# Altium schematic sheet MainSch.SchDoc
size A3; SheetNumber: 1; SheetTotal: 1
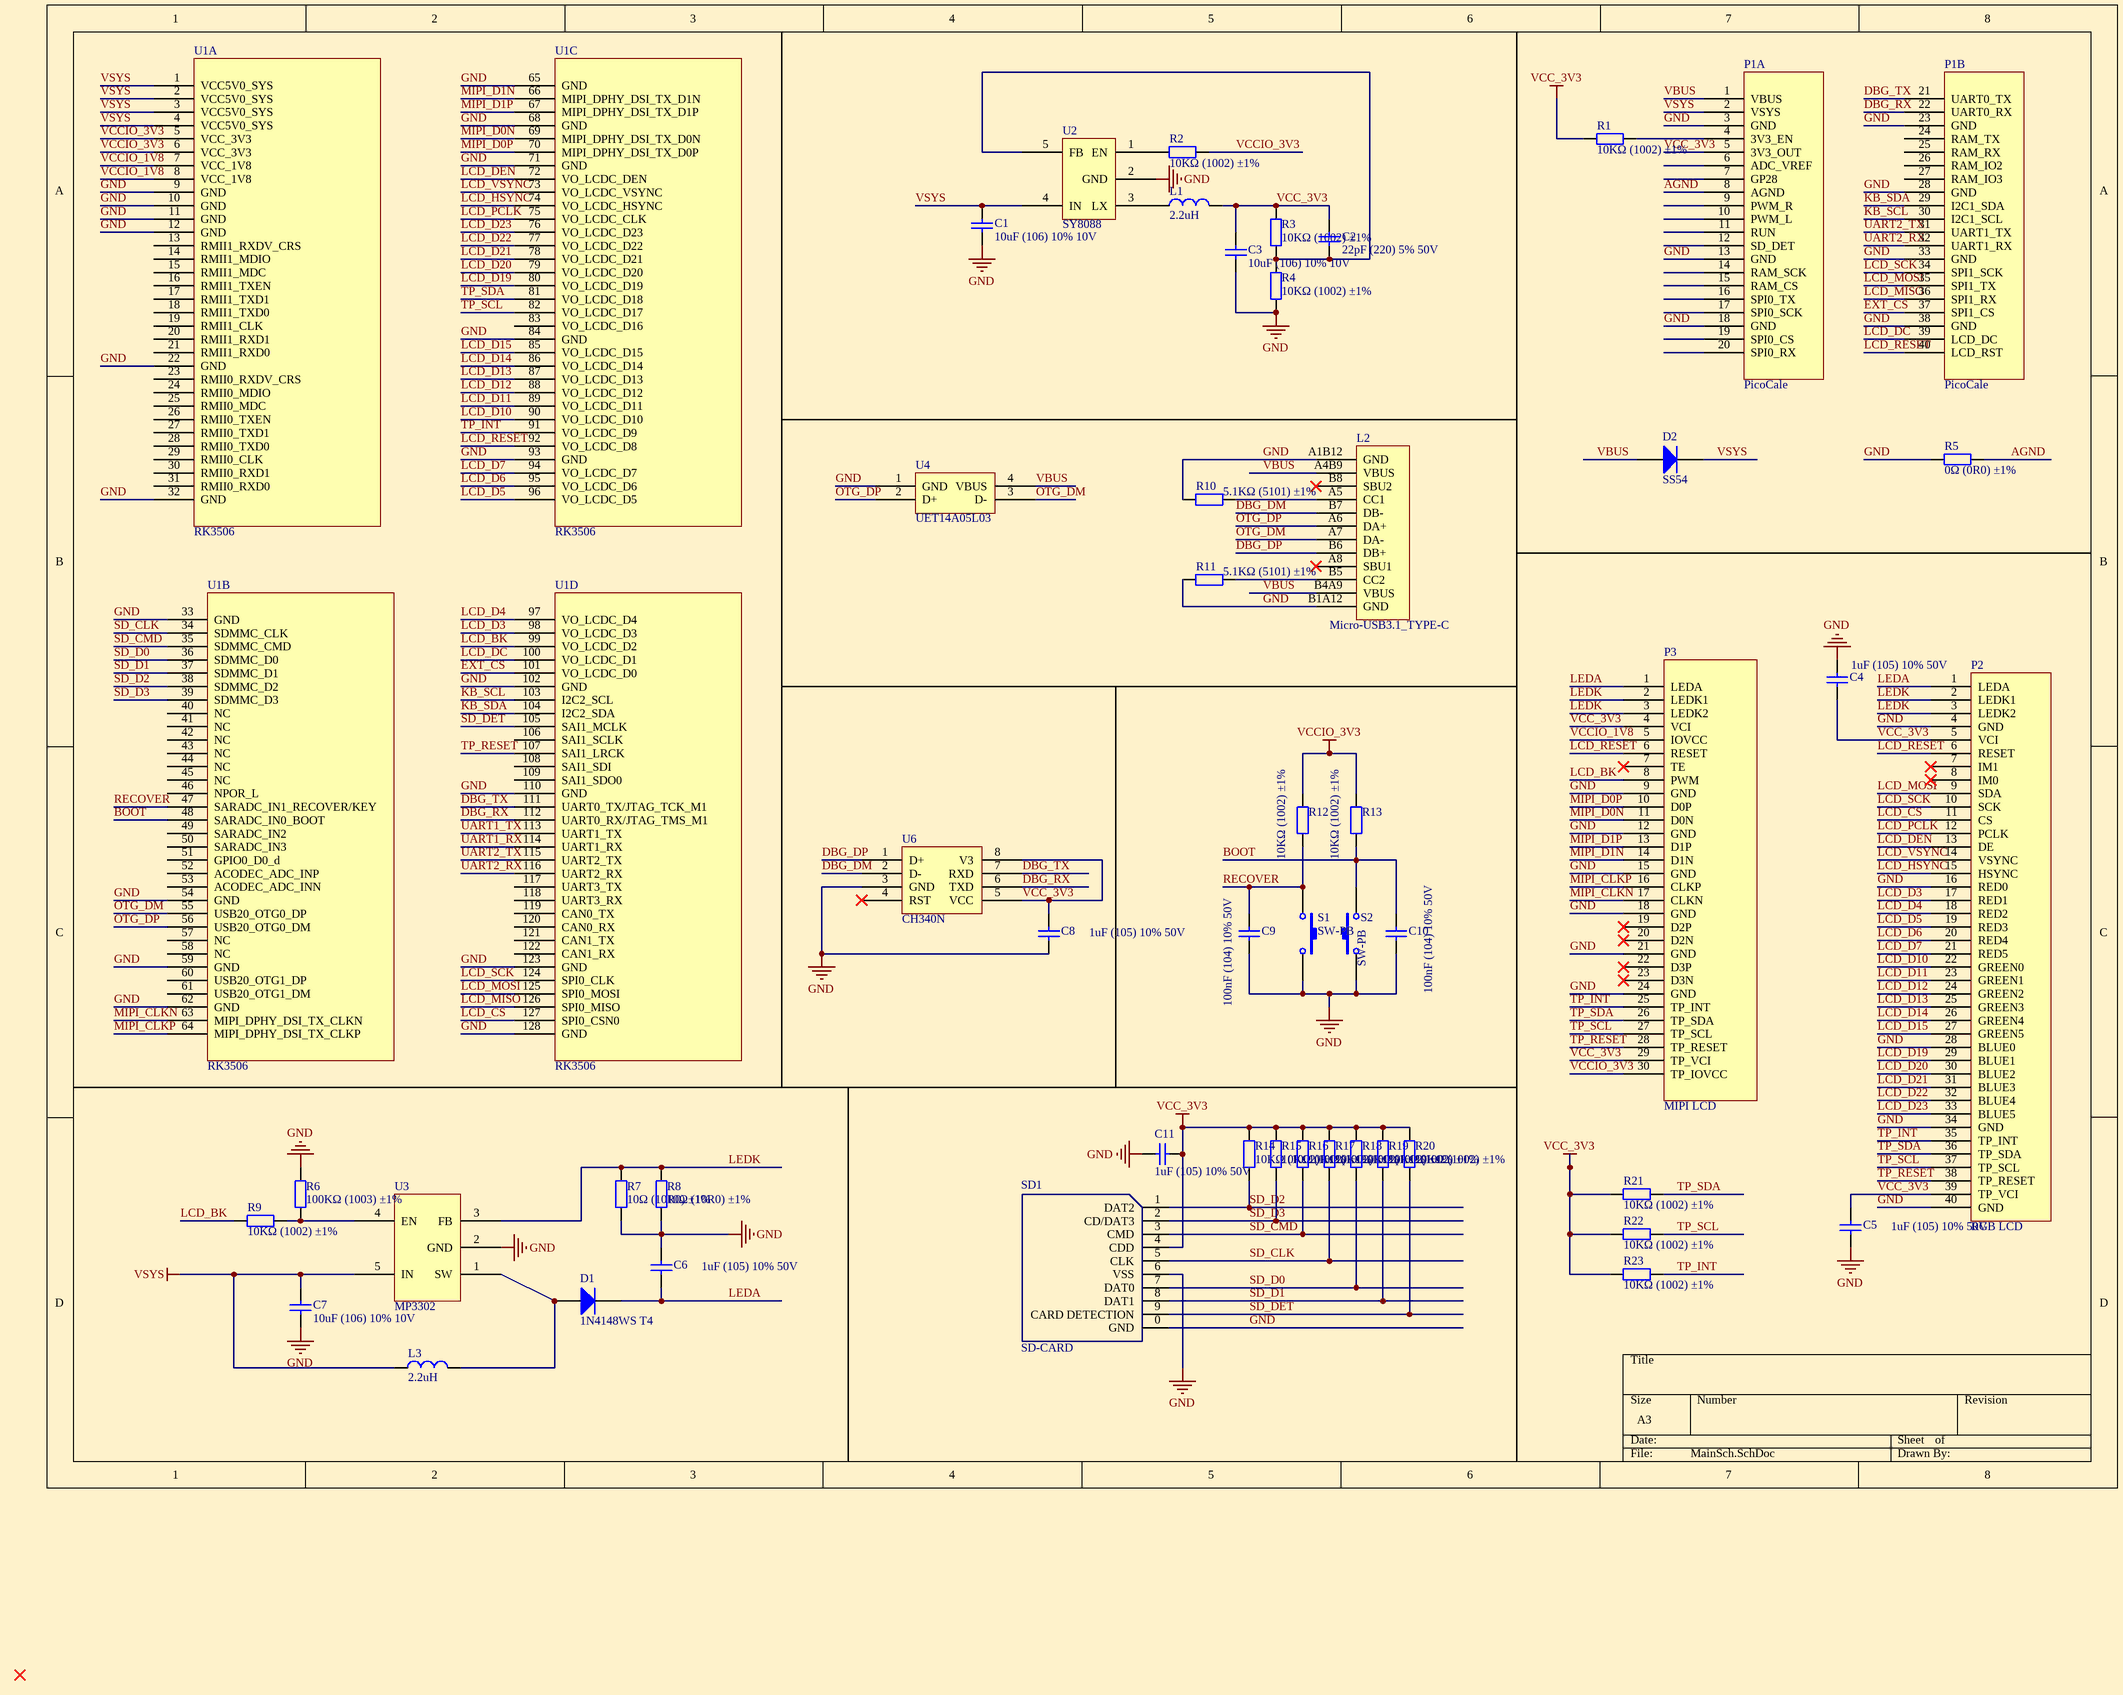
[diagram p0: MainSch.SchDoc]

## Parts
C1  10uF (106) 10% 10V  [LC-0603_C]
C2  22pF (220) 5% 50V  [LC-0603_C]
C3  10uF (106) 10% 10V  [LC-0603_C]
C4  1uF (105) 10% 50V  [LC-0603_C]
C5  1uF (105) 10% 50V  [LC-0603_C]
C6  1uF (105) 10% 50V  [LC-0603_C]
C7  10uF (106) 10% 10V  [LC-0603_C]
C8  1uF (105) 10% 50V  [LC-0603_C]
C9  100nF (104) 10% 50V  [LC-0603_C]
C10  100nF (104) 10% 50V  [LC-0603_C]
C11  1uF (105) 10% 50V  [LC-0603_C]
D1  1N4148WS T4  [LC-SOD-323]
D2  SS54  [LC-SMA(DO-214AC)_S1]
L1  2.2uH  [L-CD52]
L2  Micro-USB3.1_TYPE-C  [USB_TypeC_SMD_16P]
L3  2.2uH  [L-CD52]
P1  PicoCale  [Pico]  (parts A,B of 2)
P2  RGB LCD  [FPC0.5-40]
P3  MIPI LCD  [FPC0.5-30]
R1  10KΩ (1002) ±1%  [LC-0603_R]
R2  10KΩ (1002) ±1%  [LC-0603_R]
R3  10KΩ (1002) ±1%  [LC-0603_R]
R4  10KΩ (1002) ±1%  [LC-0603_R]
R5  0Ω (0R0) ±1%  [LC-0603_R]
R6  100KΩ (1003) ±1%  [LC-0603_R]
R7  10Ω (10R0) ±1%  [LC-0603_R]
R8  10Ω (10R0) ±1%  [LC-0603_R]
R9  10KΩ (1002) ±1%  [LC-0603_R]
R10  5.1KΩ (5101) ±1%  [LC-0603_R]
R11  5.1KΩ (5101) ±1%  [LC-0603_R]
R12  10KΩ (1002) ±1%  [LC-0603_R]
R13  10KΩ (1002) ±1%  [LC-0603_R]
R14  10KΩ (1002) ±1%  [LC-0603_R]
R15  10KΩ (1002) ±1%  [LC-0603_R]
R16  10KΩ (1002) ±1%  [LC-0603_R]
R17  10KΩ (1002) ±1%  [LC-0603_R]
R18  10KΩ (1002) ±1%  [LC-0603_R]
R19  10KΩ (1002) ±1%  [LC-0603_R]
R20  10KΩ (1002) ±1%  [LC-0603_R]
R21  10KΩ (1002) ±1%  [LC-0603_R]
R22  10KΩ (1002) ±1%  [LC-0603_R]
R23  10KΩ (1002) ±1%  [LC-0603_R]
S1  SW-PB  [TS-1030]
S2  SW-PB  [TS-1030]
SD1  SD-CARD  [SD-CARD-Micro]
U1  RK3506  [RK3506]  (parts A,B,C,D of 4)
U2  SY8088  [SOT23-5]
U3  MP3302  [SOT23-5]
U4  UET14A05L03  [SOT-143]
U6  CH340N  [SOP8]

## Nets
GND: C1.1 C3.1 C4.1 C5.1 C6.2 C7.1 C8.1 C9.1 C10.1 C11.2 L2.A1B12(GND) L2.B1A12(GND) P1.3(GND) P1.13(GND) P1.18(GND) P1.23(GND) P1.28(GND) P1.33(GND) P1.38(GND) P2.4(GND) P2.16(RED0) P2.28(BLUE0) P2.34(GND) P2.40(GND) P3.9(GND) P3.12(GND) P3.15(GND) P3.18(GND) P3.21(GND) P3.24(GND) R4.1 R5.1 R6.2 R7.1 R8.1 R10.1 R11.1 S1.2 S2.1 SD1.0(GND) SD1.6(VSS) U1.9(GND) U1.10(GND) U1.11(GND) U1.12(GND) U1.22(GND) U1.32(GND) U1.33(GND) U1.54(GND) U1.59(GND) U1.62(GND) U1.65(GND) U1.68(GND) U1.71(GND) U1.84(GND) U1.93(GND) U1.102(GND) U1.110(GND) U1.123(GND) U1.128(GND) U2.2(GND) U3.2(GND) U4.1(GND) U6.3(GND)
VCC_3V3: C2.2 C3.2 C4.2 C5.2 C8.2 C11.1 L1.1 P1.5(3V3_OUT) P2.5(VCI) P2.39(TP_VCI) P3.4(VCI) P3.29(TP_VCI) R1.1 R3.2 R14.2 R15.2 R16.2 R17.2 R18.2 R19.2 R20.2 R21.2 R22.2 R23.2 SD1.4(CDD) U6.5(VCC) U6.8(V3)
VCCIO_3V3: P3.30(TP_IOVCC) R2.2 R12.2 R13.2 U1.5(VCC_3V3) U1.6(VCC_3V3)
VSYS: C1.2 C7.2 D2.2(K) L3.2 P1.2(VSYS) U1.1(VCC5V0_SYS) U1.2(VCC5V0_SYS) U1.3(VCC5V0_SYS) U1.4(VCC5V0_SYS) U2.4(IN) U3.5(IN)
AGND: P1.8(AGND) R5.2
BOOT: C10.2 R13.1 S2.2 U1.48(SARADC_IN0_BOOT)
DBG_DM: L2.B7(DB-) U6.2(D-)
DBG_DP: L2.B6(DB+) U6.1(D+)
DBG_RX: P1.22(UART0_RX) U1.112(UART0_RX/JTAG_TMS_M1) U6.6(TXD)
DBG_TX: P1.21(UART0_TX) U1.111(UART0_TX/JTAG_TCK_M1) U6.7(RXD)
EXT_CS: P1.37(SPI1_CS) U1.101(VO_LCDC_D0)
KB_SCL: P1.30(I2C1_SCL) U1.103(I2C2_SCL)
KB_SDA: P1.29(I2C1_SDA) U1.104(I2C2_SDA)
LCD_BK: P3.8(PWM) R9.1 U1.99(VO_LCDC_D2)
LCD_CS: P2.11(CS) U1.127(SPI0_CSN0)
LCD_D3: P2.17(RED1) U1.98(VO_LCDC_D3)
LCD_D4: P2.18(RED2) U1.97(VO_LCDC_D4)
LCD_D5: P2.19(RED3) U1.96(VO_LCDC_D5)
LCD_D6: P2.20(RED4) U1.95(VO_LCDC_D6)
LCD_D7: P2.21(RED5) U1.94(VO_LCDC_D7)
LCD_D10: P2.22(GREEN0) U1.90(VO_LCDC_D10)
LCD_D11: P2.23(GREEN1) U1.89(VO_LCDC_D11)
LCD_D12: P2.24(GREEN2) U1.88(VO_LCDC_D12)
LCD_D13: P2.25(GREEN3) U1.87(VO_LCDC_D13)
LCD_D14: P2.26(GREEN4) U1.86(VO_LCDC_D14)
LCD_D15: P2.27(GREEN5) U1.85(VO_LCDC_D15)
LCD_D19: P2.29(BLUE1) U1.80(VO_LCDC_D19)
LCD_D20: P2.30(BLUE2) U1.79(VO_LCDC_D20)
LCD_D21: P2.31(BLUE3) U1.78(VO_LCDC_D21)
LCD_D22: P2.32(BLUE4) U1.77(VO_LCDC_D22)
LCD_D23: P2.33(BLUE5) U1.76(VO_LCDC_D23)
LCD_DC: P1.39(LCD_DC) U1.100(VO_LCDC_D1)
LCD_DEN: P2.13(DE) U1.72(VO_LCDC_DEN)
LCD_HSYNC: P2.15(HSYNC) U1.74(VO_LCDC_HSYNC)
LCD_MISO: P1.36(SPI1_RX) U1.126(SPI0_MISO)
LCD_MOSI: P1.35(SPI1_TX) P2.9(SDA) U1.125(SPI0_MOSI)
LCD_PCLK: P2.12(PCLK) U1.75(VO_LCDC_CLK)
LCD_RESET: P1.40(LCD_RST) P2.6(RESET) P3.6(RESET) U1.92(VO_LCDC_D8)
LCD_SCK: P1.34(SPI1_SCK) P2.10(SCK) U1.124(SPI0_CLK)
LCD_VSYNC: P2.14(VSYNC) U1.73(VO_LCDC_VSYNC)
LEDA: C6.1 D1.2(K) P2.1(LEDA) P3.1(LEDA)
LEDK: P2.2(LEDK1) P2.3(LEDK2) P3.2(LEDK1) P3.3(LEDK2) R7.2 R8.2 U3.3(FB)
MIPI_CLKN: P3.17(CLKN) U1.63(MIPI_DPHY_DSI_TX_CLKN)
MIPI_CLKP: P3.16(CLKP) U1.64(MIPI_DPHY_DSI_TX_CLKP)
MIPI_D0N: P3.11(D0N) U1.69(MIPI_DPHY_DSI_TX_D0N)
MIPI_D0P: P3.10(D0P) U1.70(MIPI_DPHY_DSI_TX_D0P)
MIPI_D1N: P3.14(D1N) U1.66(MIPI_DPHY_DSI_TX_D1N)
MIPI_D1P: P3.13(D1P) U1.67(MIPI_DPHY_DSI_TX_D1P)
OTG_DM: L2.A7(DA-) U1.55(USB20_OTG0_DP) U4.3(D-)
OTG_DP: L2.A6(DA+) U1.56(USB20_OTG0_DM) U4.2(D+)
RECOVER: C9.2 R12.1 S1.1 U1.47(SARADC_IN1_RECOVER/KEY)
SD_CLK: R17.1 SD1.5(CLK) U1.34(SDMMC_CLK)
SD_CMD: R16.1 SD1.3(CMD) U1.35(SDMMC_CMD)
SD_D0: R18.1 SD1.7(DAT0) U1.36(SDMMC_D0)
SD_D1: R19.1 SD1.8(DAT1) U1.37(SDMMC_D1)
SD_D2: R14.1 SD1.1(DAT2) U1.38(SDMMC_D2)
SD_D3: R15.1 SD1.2(CD/DAT3) U1.39(SDMMC_D3)
SD_DET: R20.1 SD1.9(CARD_DETECTION) U1.105(SAI1_MCLK)
TP_INT: P2.35(TP_INT) P3.25(TP_INT) R23.1 U1.91(VO_LCDC_D9)
TP_RESET: P2.38(TP_RESET) P3.28(TP_RESET) U1.107(SAI1_LRCK)
TP_SCL: P2.37(TP_SCL) P3.27(TP_SCL) R22.1 U1.82(VO_LCDC_D17)
TP_SDA: P2.36(TP_SDA) P3.26(TP_SDA) R21.1 U1.81(VO_LCDC_D18)
UART1_RX: U1.114(UART1_RX)
UART1_TX: U1.113(UART1_TX)
UART2_RX: P1.32(UART1_RX) U1.116(UART2_RX)
UART2_TX: P1.31(UART1_TX) U1.115(UART2_TX)
VBUS: D2.1(A) L2.A4B9(VBUS) L2.B4A9(VBUS) P1.1(VBUS) U4.4(VBUS)
VCCIO_1V8: P3.5(IOVCC) U1.7(VCC_1V8) U1.8(VCC_1V8)
NetC2_1: C2.1 R3.1 R4.2 U2.5(FB)
NetD1_1: D1.1(A) L3.1 U3.1(SW)
NetL1_2: L1.2 U2.3(LX)
NetL2_A5: L2.A5(CC1) R10.2
NetL2_B5: L2.B5(CC2) R11.2
NetP1_4: P1.4(3V3_EN) R1.2
NetR2_1: R2.1 U2.1(EN)
NetR6_1: R6.1 R9.2 U3.4(EN)

Not connected (* = marked no-connect by the designer): L2 A8(SBU1)* B8(SBU2)*; P1 6(ADC_VREF) 7(GP28) 9(PWM_R) 10(PWM_L) 11(RUN) 12(SD_DET) 14(RAM_SCK) 15(RAM_CS) 16(SPI0_TX) 17(SPI0_SCK) 19(SPI0_CS) 20(SPI0_RX) 24(RAM_TX) 25(RAM_RX) 26(RAM_IO2) 27(RAM_IO3); P2 7(IM1)* 8(IM0)*; P3 7(TE)* 19(D2P)* 20(D2N)* 22(D3P)* 23(D3N)*; U1 13(RMII1_RXDV_CRS) 14(RMII1_MDIO) 15(RMII1_MDC) 16(RMII1_TXEN) 17(RMII1_TXD1) 18(RMII1_TXD0) 19(RMII1_CLK) 20(RMII1_RXD1) 21(RMII1_RXD0) 23(RMII0_RXDV_CRS) 24(RMII0_MDIO) 25(RMII0_MDC) 26(RMII0_TXEN) 27(RMII0_TXD1) 28(RMII0_TXD0) 29(RMII0_CLK) 30(RMII0_RXD1) 31(RMII0_RXD0) 40(NC) 41(NC) 42(NC) 43(NC) 44(NC) 45(NC) 46(NPOR_L) 49(SARADC_IN2) 50(SARADC_IN3) 51(GPIO0_D0_d) 52(ACODEC_ADC_INP) 53(ACODEC_ADC_INN) 57(NC) 58(NC) 60(USB20_OTG1_DP) 61(USB20_OTG1_DM) 83(VO_LCDC_D16) 106(SAI1_SCLK) 108(SAI1_SDI) 109(SAI1_SDO0) 117(UART3_TX) 118(UART3_RX) 119(CAN0_TX) 120(CAN0_RX) 121(CAN1_TX) 122(CAN1_RX); U6 4(RST)*

## Library data of the parts
C1 C3 C7 = 0603 10uF (106) 10% 10V: 贴片电容; ComponentLink1Description: 供应商链接; ComponentLink1URL: http://www.szlcsc.com/product/details_20411.html; Package: 0603; Supplier: LC; SuppliersPartNumber: C19702
C2 = 0603 22pF (220) 5% 50V: 贴片电容; ComponentLink1Description: 供应商链接; ComponentLink1URL: http://www.szlcsc.com/product/details_2005.html; Package: 0603; Supplier: LC; SuppliersPartNumber: C1653
C4-C6 C8 C11 = 0603 1uF (105) 10% 50V: 贴片电容; ComponentLink1Description: 供应商链接; ComponentLink1URL: http://www.szlcsc.com/product/details_16531.html; Package: 0603; Supplier: LC; SuppliersPartNumber: C15849
C9 C10 = 0603 100nF (104) 10% 50V: 贴片电容; ComponentLink1Description: 供应商链接; ComponentLink1URL: http://www.szlcsc.com/product/details_15331.html; Package: 0603; Supplier: LC; SuppliersPartNumber: C14663
D1 = SOD-323 1N4148WS T4: 二极管; ComponentLink1Description: 供应商链接; ComponentLink1URL: http://www.szlcsc.com/product/details_2485.html; Package: SOD-323; Supplier: LC; SuppliersPartNumber: C2128
D2 = SMA(DO-214AC) SS54: 二极管; ComponentLink1Description: 供应商链接; ComponentLink1URL: http://www.szlcsc.com/product/details_23178.html; Package: SMA(DO-214AC); Supplier: LC; SuppliersPartNumber: C22452
L1 L3 = INDUCTOR: 电感; Text Field1: 20; Text Field2: 30
P1 = PicoCale_Socket
P2 = RGB_40PIN
P3 = MIPI_30P
R1-R4 R9 R12-R23 = 0603 10KΩ (1002) 1%: 贴片电阻; ComponentLink1Description: 供应商链接; ComponentLink1URL: http://www.szlcsc.com/product/details_26547.html; Package: 0603; Supplier: LC; SuppliersPartNumber: C25804
R5 = 0603 0Ω (0R0) 1%: 贴片电阻; ComponentLink1Description: 供应商链接; ComponentLink1URL: http://www.szlcsc.com/product/details_21903.html; Package: 0603; Supplier: LC; SuppliersPartNumber: C21189
R6 = 0603 100KΩ (1003) 1%: 贴片电阻; ComponentLink1Description: 供应商链接; ComponentLink1URL: http://www.szlcsc.com/product/details_26546.html; Package: 0603; Supplier: LC; SuppliersPartNumber: C25803
R7 R8 = 0603 10Ω (10R0) 1%: 贴片电阻; ComponentLink1Description: 供应商链接; ComponentLink1URL: http://www.szlcsc.com/product/details_23586.html; Package: 0603; Supplier: LC; SuppliersPartNumber: C22859
R10 R11 = 0603 5.1KΩ (5101) 1%: 贴片电阻; ComponentLink1Description: 供应商链接; ComponentLink1URL: http://www.szlcsc.com/product/details_23913.html; Package: 0603; Supplier: LC; SuppliersPartNumber: C23186
S1 S2 = SW-PB: 轻触开关; Published: 24-Mar-1999; LatestRevisionDate: 17-Jul-2002; LatestRevisionNote: Re-released for DXP Platform.; PackageReference: SPST-2; Publisher: Altium Limited; PackageDescription: Switch; 2 Leads
U1 = RK3506G_CORE